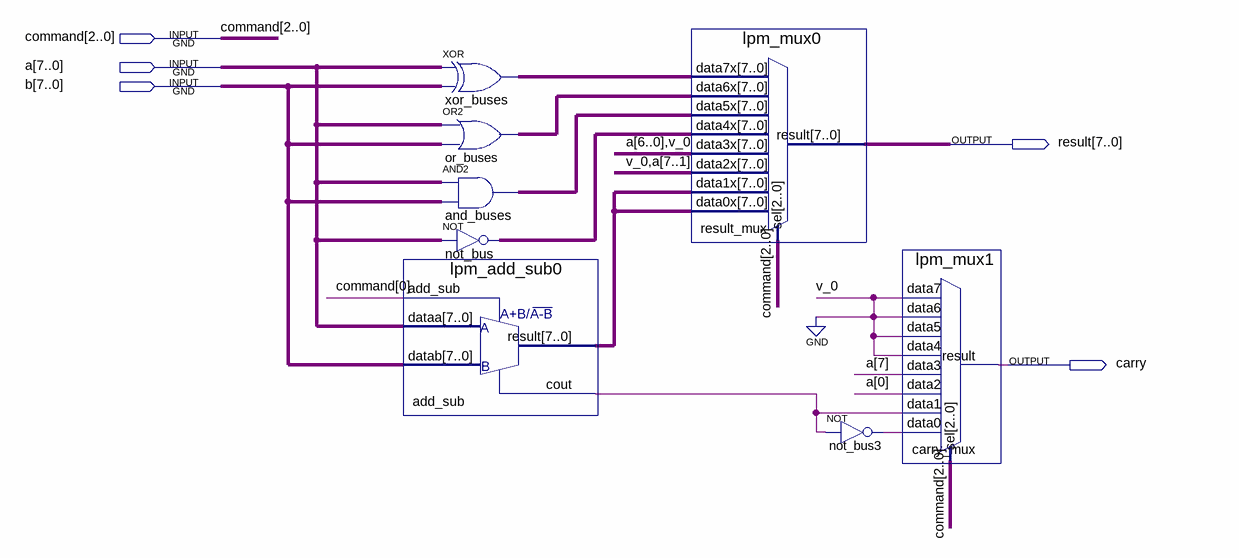
[diagram p0: schematic sheet]
// Quartus schematic alu_schematic.bdf as structural Verilog: 8 symbols, 5 pins
module alu_schematic (
  input  [2:0] command,
  input  [7:0] a,
  input  [7:0] b,
  output [7:0] result,
  output carry
);

  wire add_sub_cout, not_bus3_out;
  wire [7:0] add_sub_result, and_buses_out, not_bus_out, or_buses_out, xor_buses_out;

  lpm_add_sub0 add_sub (.add_sub(command[0]), .dataa(a), .datab(b), .result(add_sub_result), .cout(add_sub_cout));
  assign xor_buses_out = a ^ b;  // XOR xor_buses, 8 bits wide
  assign or_buses_out = a | b;  // OR2 or_buses, 8 bits wide
  assign and_buses_out = a & b;  // AND2 and_buses, 8 bits wide
  assign not_bus_out = ~a;  // NOT not_bus, 8 bits wide
  lpm_mux0 result_mux (
    .data7x(xor_buses_out), .data6x(or_buses_out), .data5x(and_buses_out), .data4x(not_bus_out),
    .data3x({a[6:0], 1'b0}), .data2x({1'b0, a[7:1]}), .data1x(add_sub_result), .data0x(add_sub_result),
    .sel(command), .result(result));
  not not_bus3 (not_bus3_out, add_sub_cout);
  lpm_mux1 carry_mux (
    .data7(1'b0), .data6(1'b0), .data5(1'b0), .data4(1'b0), .data3(a[7]), .data2(a[0]), .data1(add_sub_cout),
    .data0(not_bus3_out), .sel(command), .result(carry));
endmodule
